# EAGLE design cryptocape (EAGLE 6.5.0)
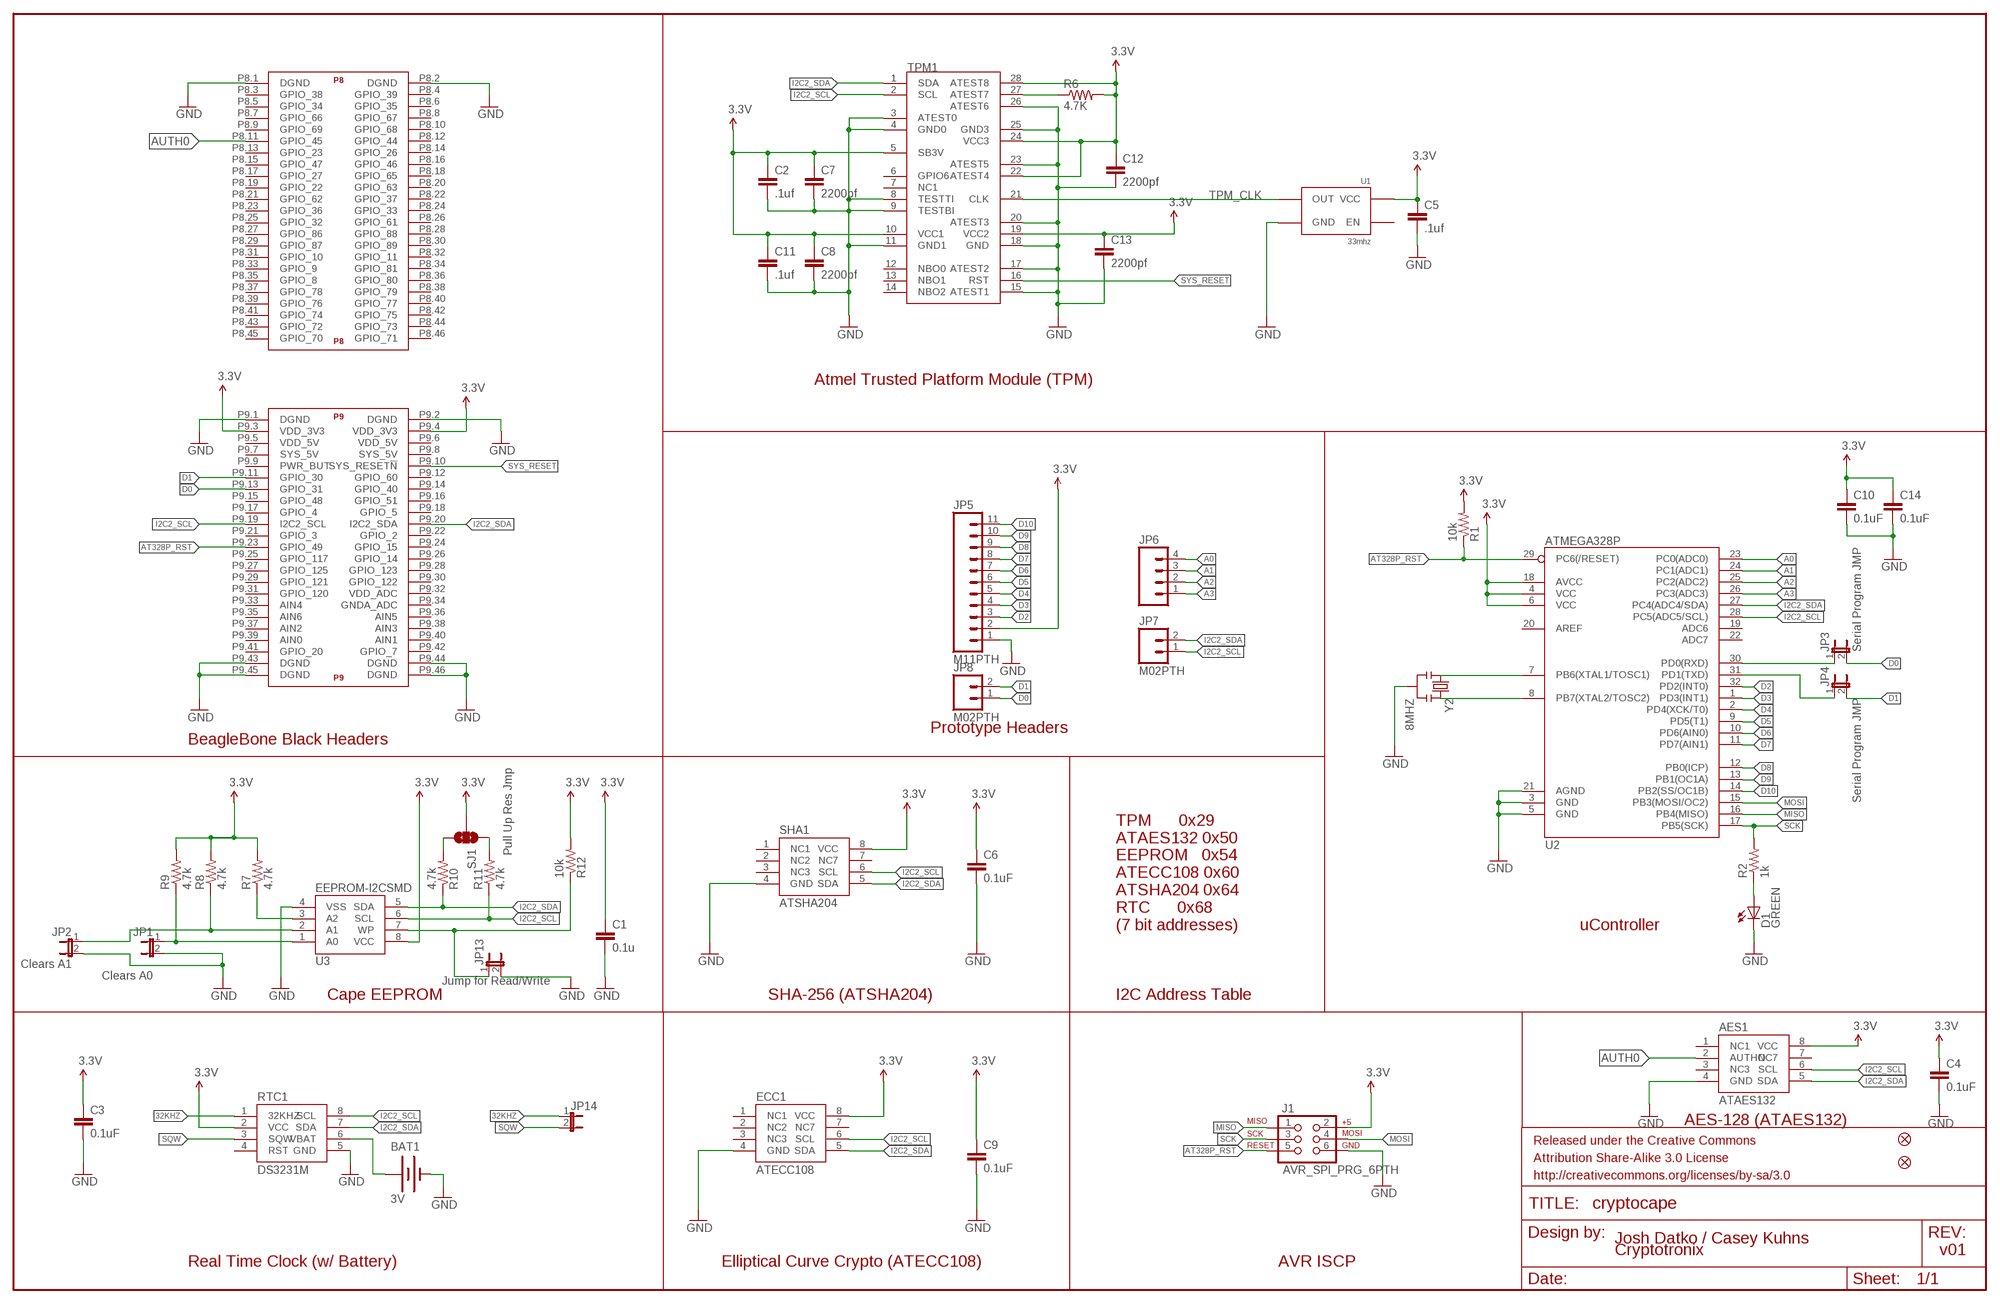
[diagram p0: schematic, sheet 1]

## Parts
AES1  ATAES132  [SOIC8]
BAT1  3V  BATTERY12MM  [BATTCON_12MM]
C1  0.1u  0.1UF-25V(+80/-20%)(0603)  [0603-CAP]
C2  .1uf  0.1UF-25V(+80/-20%)(0603)  [0603-CAP]
C3  0.1uF  0.1UF-25V(+80/-20%)(0603)  [0603-CAP]
C4  0.1uF  0.1UF-25V(+80/-20%)(0603)  [0603-CAP]
C5  .1uf  0.1UF-25V(+80/-20%)(0603)  [0603-CAP]
C6  0.1uF  0.1UF-25V(+80/-20%)(0603)  [0603-CAP]
C7  2200pf  2.2NF/2200PF-50V-10%(0603)  [0603-CAP]
C8  2200pf  2.2NF/2200PF-50V-10%(0603)  [0603-CAP]
C9  0.1uF  0.1UF-25V(+80/-20%)(0603)  [0603-CAP]
C10  0.1uF  0.1UF-25V(+80/-20%)(0603)  [0603-CAP]
C11  .1uf  0.1UF-25V(+80/-20%)(0603)  [0603-CAP]
C12  2200pf  2.2NF/2200PF-50V-10%(0603)  [0603-CAP]
C13  2200pf  2.2NF/2200PF-50V-10%(0603)  [0603-CAP]
C14  0.1uF  0.1UF-25V(+80/-20%)(0603)  [0603-CAP]
D1  GREEN  LED-GREEN0603  [LED-0603]
ECC1  ATECC108  [SOIC8]
FID1  FIDUCIAL1X2  [FIDUCIAL-1X2]
FID2  FIDUCIAL1X2  [FIDUCIAL-1X2]
FRAME1  FRAME-LEDGER  [CREATIVE_COMMONS]
J1  AVR_SPI_PRG_6PTH  [2X3]
JP1  Clears A0  JUMPER-2SMD-NO  [SJ_2S-NO]
JP2  Clears A1  JUMPER-2SMD-NO  [SJ_2S-NO]
JP3  Serial Program JMP  JUMPER-2PTH  [1X02]
JP4  Serial Program JMP  JUMPER-2PTH  [1X02]
JP5  M11PTH  [1X11]
JP6  M04PTH  [1X04]
JP7  M02PTH  [1X02]
JP8  M02PTH  [1X02]
JP13  Jump for Read/Write  JUMPER-2PTH  [1X02]
JP14  JUMPER-2PTH  [1X02]
R1  10k  10KOHM1/10W1%(0603)0603  [0603-RES]
R2  1k  1K-1%  [0603-RES]
R6  4.7K  4.7KOHM1/10W1%(0603)  [0603]
R7  4.7k  4.7KOHM1/10W1%(0603)  [0603]
R8  4.7k  4.7KOHM1/10W1%(0603)  [0603]
R9  4.7k  4.7KOHM1/10W1%(0603)  [0603]
R10  4.7k  4.7KOHM1/10W1%(0603)  [0603]
R11  4.7k  4.7KOHM1/10W1%(0603)  [0603]
R12  10k  10KOHM1/10W1%(0603)0603  [0603-RES]
RTC1  DS3231M  [SOIC8]
SHA1  ATSHA204  [SOIC8]
SJ1  Pull Up Res Jmp  SOLDERJUMPER_2WAYPASTE1&2&3  [SJ_3_PASTE1&2&3]
TPM1  AT97SC3204T  [TSSOP28]
U1  33mhz  OSCILLATOR  [CRYSTAL-OSC-SMD-5X3.2]
U2  ATMEGA328P  ATMEGA328_SMT  [TQFP32-08]
U3  EEPROM-I2CSMD  [SO08]
U$2  BEAGLE_BONE_BLACK_CAPE  [BEAGLE_BONE_BLACK_CAPE]
Y2  8MHZ  RESONATOR8MHZ  [RESONATOR-SMD]

## Nets
3.3V: AES1.8(VCC) C1.1 C2.1 C3.1 C4.1 C5.1 C6.1 C7.1 C8.1 C9.1 C10.1 C11.1 C12.1 C13.1 C14.1 ECC1.8(VCC) J1.2 JP5.2 R1.2 R6.2 R7.2 R8.2 R9.2 R12.2 RTC1.2(VCC) SHA1.8(VCC) SJ1.2 TPM1.5(SB3V) TPM1.10(VCC1) TPM1.19(VCC2) TPM1.22(ATEST4) TPM1.24(VCC3) TPM1.28(ATEST8) U1.4(VCC) U2.4(VCC) U2.6(VCC) U2.18(AVCC) U3.8(VCC) U$2.P9.3(P9:VDD_3V3) U$2.P9.4(P9:VDD_3V3)
32KHZ: JP14.1 RTC1.1(32KHZ)
A0: JP6.4 U2.23(PC0(ADC0))
A1: JP6.3 U2.24(PC1(ADC1))
A2: JP6.2 U2.25(PC2(ADC2))
A3: JP6.1 U2.26(PC3(ADC3))
AT328P_RST: J1.5 R1.1 U2.29(PC6(/RESET)) U$2.P9.23(P9:GPIO_49)
AUTH0: AES1.2(AUTHO) U$2.P8.11(P8:GPIO_45)
D0: JP3.2 JP8.1 U$2.P9.13(P9:GPIO_31)
D0': JP3.1 U2.30(PD0(RXD))
D1: JP4.2 JP8.2 U$2.P9.11(P9:GPIO_30)
D1': JP4.1 U2.31(PD1(TXD))
D2: JP5.3 U2.32(PD2(INT0))
D3: JP5.4 U2.1(PD3(INT1))
D4: JP5.5 U2.2(PD4(XCK/T0))
D5: JP5.6 U2.9(PD5(T1))
D6: JP5.7 U2.10(PD6(AIN0))
D7: JP5.8 U2.11(PD7(AIN1))
D8: JP5.9 U2.12(PB0(ICP))
D9: JP5.10 U2.13(PB1(OC1A))
D10: JP5.11 U2.14(PB2(SS/OC1B))
GND: AES1.4(GND) BAT1.GND(-) C1.2 C2.2 C3.2 C4.2 C5.2 C6.2 C7.2 C8.2 C9.2 C10.2 C11.2 C12.2 C13.2 C14.2 D1.C ECC1.4(GND) J1.6 JP1.2 JP2.2 JP5.1 JP13.2 RTC1.5(GND) SHA1.4(GND) TPM1.3(ATEST0) TPM1.4(GND0) TPM1.8(TESTTI) TPM1.9(TESTBI) TPM1.11(GND1) TPM1.15(ATEST1) TPM1.17(ATEST2) TPM1.18(GND) TPM1.20(ATEST3) TPM1.23(ATEST5) TPM1.25(GND3) TPM1.26(ATEST6) U1.2(GND) U2.3(GND) U2.5(GND) U2.21(AGND) U3.4(VSS) U$2.P8.1(P8:DGND) U$2.P8.2(P8:DGND) U$2.P9.1(P9:DGND) U$2.P9.2(P9:DGND) U$2.P9.43(P9:DGND) U$2.P9.44(P9:DGND) U$2.P9.45(P9:DGND) U$2.P9.46(P9:DGND) Y2.2
I2C2_SCL: AES1.6(SCL) ECC1.6(SCL) JP7.1 R11.1 RTC1.8(SCL) SHA1.6(SCL) TPM1.2(SCL) U2.28(PC5(ADC5/SCL)) U3.6(SCL) U$2.P9.19(P9:I2C2_SCL)
I2C2_SDA: AES1.5(SDA) ECC1.5(SDA) JP7.2 R10.1 RTC1.7(SDA) SHA1.5(SDA) TPM1.1(SDA) U2.27(PC4(ADC4/SDA)) U3.5(SDA) U$2.P9.20(P9:I2C2_SDA)
MISO: J1.1 U2.16(PB4(MISO))
MOSI: J1.4 U2.15(PB3(MOSI/OC2))
N$1: JP13.1 R12.1 U3.7(WP)
N$4: U2.7(PB6(XTAL1/TOSC1)) Y2.1
N$5: U2.8(PB7(XTAL2/TOSC2)) Y2.3
N$12: D1.A R2.1
N$18: R7.1 U3.3(A2)
N$19: R6.1 TPM1.27(ATEST7)
N$20: JP2.1 R8.1 U3.2(A1)
N$21: JP1.1 R9.1 U3.1(A0)
N$22: R10.2 SJ1.3
N$23: R11.2 SJ1.1
SCK: J1.3 R2.2 U2.17(PB5(SCK))
SQW: JP14.2 RTC1.3(SQW)
SYS_RESET: TPM1.16(RST) U$2.P9.10(P9:SYS_RESET!N)
TPM_CLK: TPM1.21(CLK) U1.3(OUT)
VBAT: BAT1.PWR@1(+) RTC1.6(VBAT)
Unconnected: AES1.1(NC1) AES1.3(NC3) AES1.7(NC7) ECC1.1(NC1) ECC1.2(NC2) ECC1.3(NC3) ECC1.7(NC7) RTC1.4(RST) SHA1.1(NC1) SHA1.2(NC2) SHA1.3(NC3) SHA1.7(NC7) TPM1.6(GPIO6) TPM1.7(NC1) TPM1.12(NBO0) TPM1.13(NBO1) TPM1.14(NBO2) U1.1(EN) U2.19(ADC6) U2.20(AREF) U2.22(ADC7) U$2.P8.3(P8:GPIO_38) U$2.P8.4(P8:GPIO_39) U$2.P8.5(P8:GPIO_34) U$2.P8.6(P8:GPIO_35) U$2.P8.7(P8:GPIO_66) U$2.P8.8(P8:GPIO_67) U$2.P8.9(P8:GPIO_69) U$2.P8.10(P8:GPIO_68) U$2.P8.12(P8:GPIO_44) U$2.P8.13(P8:GPIO_23) U$2.P8.14(P8:GPIO_26) U$2.P8.15(P8:GPIO_47) U$2.P8.16(P8:GPIO_46) U$2.P8.17(P8:GPIO_27) U$2.P8.18(P8:GPIO_65) U$2.P8.19(P8:GPIO_22) U$2.P8.20(P8:GPIO_63) U$2.P8.21(P8:GPIO_62) U$2.P8.22(P8:GPIO_37) U$2.P8.23(P8:GPIO_36) U$2.P8.24(P8:GPIO_33) U$2.P8.25(P8:GPIO_32) U$2.P8.26(P8:GPIO_61) U$2.P8.27(P8:GPIO_86) U$2.P8.28(P8:GPIO_88) U$2.P8.29(P8:GPIO_87) U$2.P8.30(P8:GPIO_89) U$2.P8.31(P8:GPIO_10) U$2.P8.32(P8:GPIO_11) U$2.P8.33(P8:GPIO_9) U$2.P8.34(P8:GPIO_81) U$2.P8.35(P8:GPIO_8) U$2.P8.36(P8:GPIO_80) U$2.P8.37(P8:GPIO_78) U$2.P8.38(P8:GPIO_79) U$2.P8.39(P8:GPIO_76) U$2.P8.40(P8:GPIO_77) U$2.P8.41(P8:GPIO_74) U$2.P8.42(P8:GPIO_75) U$2.P8.43(P8:GPIO_72) U$2.P8.44(P8:GPIO_73) U$2.P8.45(P8:GPIO_70) U$2.P8.46(P8:GPIO_71) U$2.P9.5(P9:VDD_5V) U$2.P9.6(P9:VDD_5V) U$2.P9.7(P9:SYS_5V) U$2.P9.8(P9:SYS_5V) U$2.P9.9(P9:PWR_BUT) U$2.P9.12(P9:GPIO_60) U$2.P9.14(P9:GPIO_40) U$2.P9.15(P9:GPIO_48) U$2.P9.16(P9:GPIO_51) U$2.P9.17(P9:GPIO_4) U$2.P9.18(P9:GPIO_5) U$2.P9.21(P9:GPIO_3) U$2.P9.22(P9:GPIO_2) U$2.P9.24(P9:GPIO_15) U$2.P9.25(P9:GPIO_117) U$2.P9.26(P9:GPIO_14) U$2.P9.27(P9:GPIO_125) U$2.P9.28(P9:GPIO_123) U$2.P9.29(P9:GPIO_121) U$2.P9.30(P9:GPIO_122) U$2.P9.31(P9:GPIO_120) U$2.P9.32(P9:VDD_ADC) U$2.P9.33(P9:AIN4) U$2.P9.34(P9:GNDA_ADC) U$2.P9.35(P9:AIN6) U$2.P9.36(P9:AIN5) U$2.P9.37(P9:AIN2) U$2.P9.38(P9:AIN3) U$2.P9.39(P9:AIN0) U$2.P9.40(P9:AIN1) U$2.P9.41(P9:GPIO_20) U$2.P9.42(P9:GPIO_7)

## Notes on the sheet
- Atmel Trusted Platform Module (TPM)
- Prototype Headers
- BeagleBone Black Headers
- TPM      0x29
  ATAES132 0x50
  EEPROM   0x54
  ATECC108 0x60
  ATSHA204 0x64
  RTC      0x68
  (7 bit addresses)
- uController
- Cape EEPROM | SHA-256 (ATSHA204) | I2C Address Table
- AES-128 (ATAES132)
- Josh Datko / Casey Kuhns
- Cryptotronix | v01
- Real Time Clock (w/ Battery) | Elliptical Curve Crypto (ATECC108) | AVR ISCP

## Library data of the parts
AES1 = cryptotronix:ATAES132: 32Kb Serial EEPROM. AES-128-CCM. MAC. Secure Storage for 128-bit keys. Encrypted User Memory Readn and Write. HWRNG. 2.5V to 5.5V.
BAT1 = SparkFun-Electromechanical:BATTERY: Battery Holders Various common sizes : AA, AAA, 20mm coin cell and 12mm coin cell. 20MM_4LEGS, BATT-10373
C1 C2 C5 C11 = SparkFun-Capacitors:0.1UF-25V(+80/-20%)(0603): CAP-00810 Ceramic Standard decoupling cap; PROD_ID: CAP-00810; VALUE: 0.1uF
C3 C4 C6 C9 C10 C14 = SparkFun-Capacitors:0.1UF-25V(+80/-20%)(0603): CAP-00810 Ceramic Standard decoupling cap; PROD_ID: CAP-00810
C7 C8 C12 C13 = SparkFun-Capacitors:2.2NF/2200PF-50V-10%(0603): CAP-07877; PROD_ID: CAP-07877; VALUE: 2.2nF
D1 = SparkFun-LED:LED-GREEN: Various green LEDs 0603- DIO-00821 LARGE- DIO-00862 LILYPAD- DIO-09910; PROD_ID: DIO-00821
ECC1 = cryptotronix:ATECC108: ATECC108: Provides ECDSA with NIST curves P256, B283, and K283. Also, a RNG, 8.5Kb EEPROM. 2.0V - 5.5V.
FID1 FID2 = SparkFun-Aesthetics:FIDUCIAL: Fiducial Alignment Points Various fiducial points for machine vision alignment.
FRAME1 = SparkFun-Aesthetics:FRAME-LEDGER: Schematic Frame Standard 11x14 US Ledger frame
J1 = SparkFun-Connectors:AVR_SPI_PRG_6: AVR ISP 6 Pin This is the reduced ISP connector for AVR programming. Common on Arduino. This footprint will take up less PCB space and can be used with a 10-pin to 6-pin adapter such as SKU: BOB-08508
JP1-JP4 JP13 JP14 = SparkFun-Passives:JUMPER-2: Jumper Basic 0.1" spaced jumper. Use with breakaway headers.
JP5 = SparkFun-Connectors:M11: Header 11 Standard 11-pin 0.1" header. Use with straight break away headers (SKU : PRT-00116), right angle break away headers (PRT-00553), swiss pins (PRT-00743), machine pins (PRT-00117), and female headers (PRT-00115).
JP6 = SparkFun-Connectors:M04: Header 4 Standard 4-pin 0.1" header. Use with straight break away headers (SKU : PRT-00116), right angle break away headers (PRT-00553), swiss pins (PRT-00743), machine pins (PRT-00117), and female headers (PRT-00115). Molex polarized connector foot print use with SKU : PRT-08231 with associated crimp pins and housings. 1MM SMD Version SKU: PRT-10208
JP7 JP8 = SparkFun-Connectors:M02: Standard 2-pin 0.1" header. Use with - straight break away headers ( PRT-00116) - right angle break away headers (PRT-00553) - swiss pins (PRT-00743) - machine pins (PRT-00117) - female headers (PRT-00115) Molex polarized connector foot print use with: PRT-08233 with associated crimp pins and housings. 2.54_SCREWTERM for use with PRT-10571. 3.5mm Screw Terminal footprints for PRT-08084 5mm Screw Terminal footprints for use with PRT-08433
R1 R12 = SparkFun-Resistors:10KOHM1/10W1%(0603): RES-00824; PROD_ID: RES-00824; VALUE: 10K
R2 = SparkFun-Resistors:1K-1%: 1k-ohm SMT 1/10W - 1% (0603) RES-07856; PROD_ID: RES-07856
R6-R11 = SparkFun-Resistors:4.7KOHM1/10W1%(0603): RES-07857; PROD_ID: RES-07857
RTC1 = cryptotronix:DS3231M: DS3231M Real Time Clock. Accuracy +/-5ppm. Battery Backup. 2.3V to 5.5V.
SHA1 = cryptotronix:ATSHA204: ATSHA204
SJ1 = SparkFun-Passives:SOLDERJUMPER_2WAY: Solder Jumper 2 way solder jumper
TPM1 = cryptotronix:AT97SC3204T: Atmel TPM 1.2
U1 = cryptotronix:OSCILLATOR: Generic 5x3.2 Oscillator
U2 = SparkFun-DigitalIC:ATMEGA328_SMT: 32-Pin Atmega328 part Commonly used on Arduino compatible boards Available in QFP and QFN packages TQFP is IC-09069 QFN is non-stock; PROD_ID: IC-09069
U3 = SparkFun-DigitalIC:EEPROM-I2C: I2C EEPROM chips, 24LC256 (and others)
U$2 = SparkFun-Boards:BEAGLE_BONE_BLACK_CAPE
Y2 = SparkFun-FreqCtrl:RESONATOR: Resonator Small SMD resonator. Used, eg, on the Arduino Pro/ Pro Mini boards. 8MHz- XTAL-08895 16MHz- XTAL-08900; PROD_ID: XTAL-08895

## Board
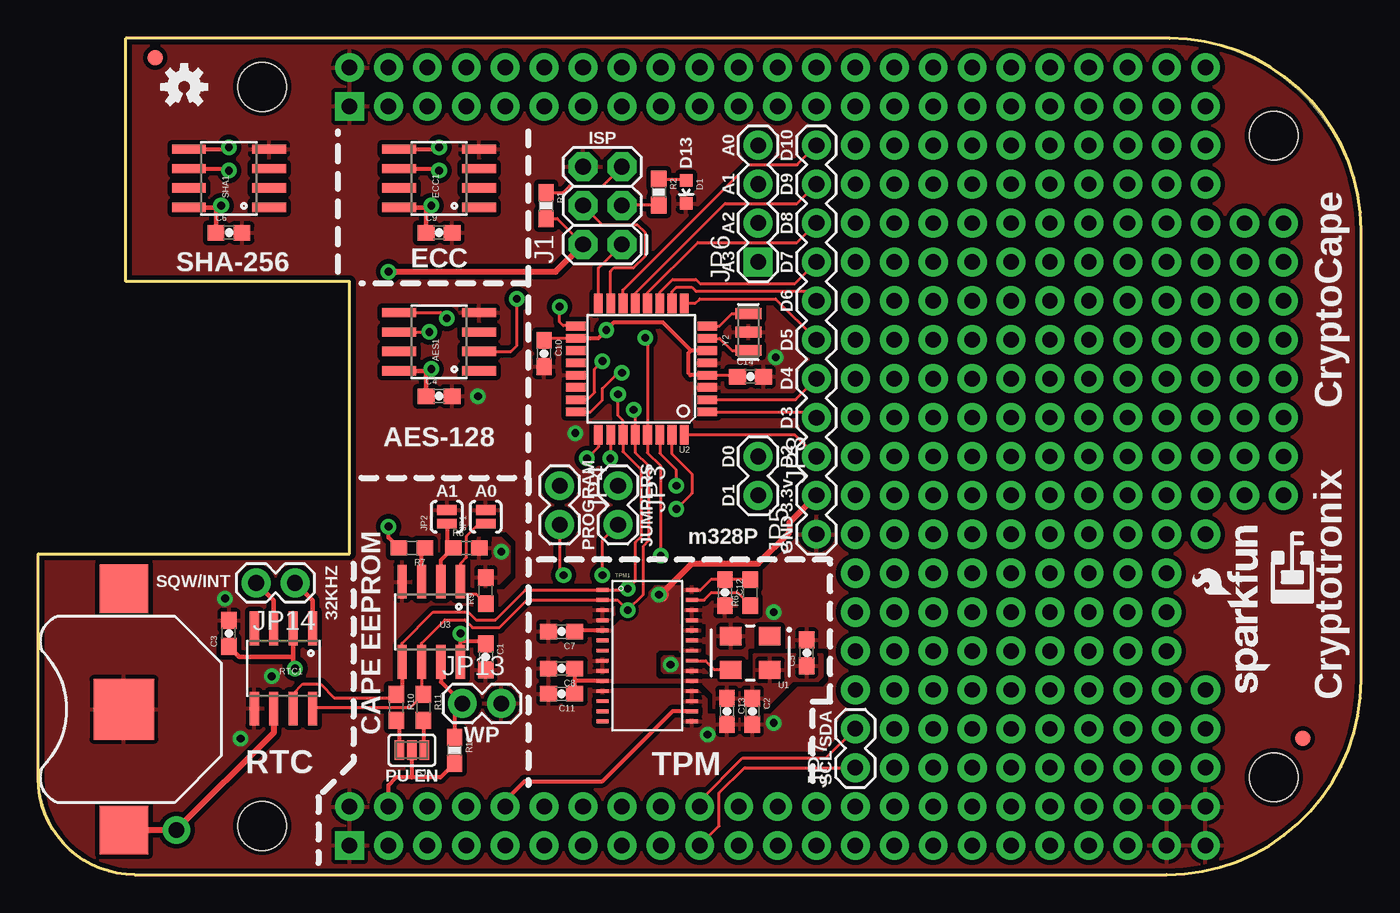
[diagram p1: board, top side]
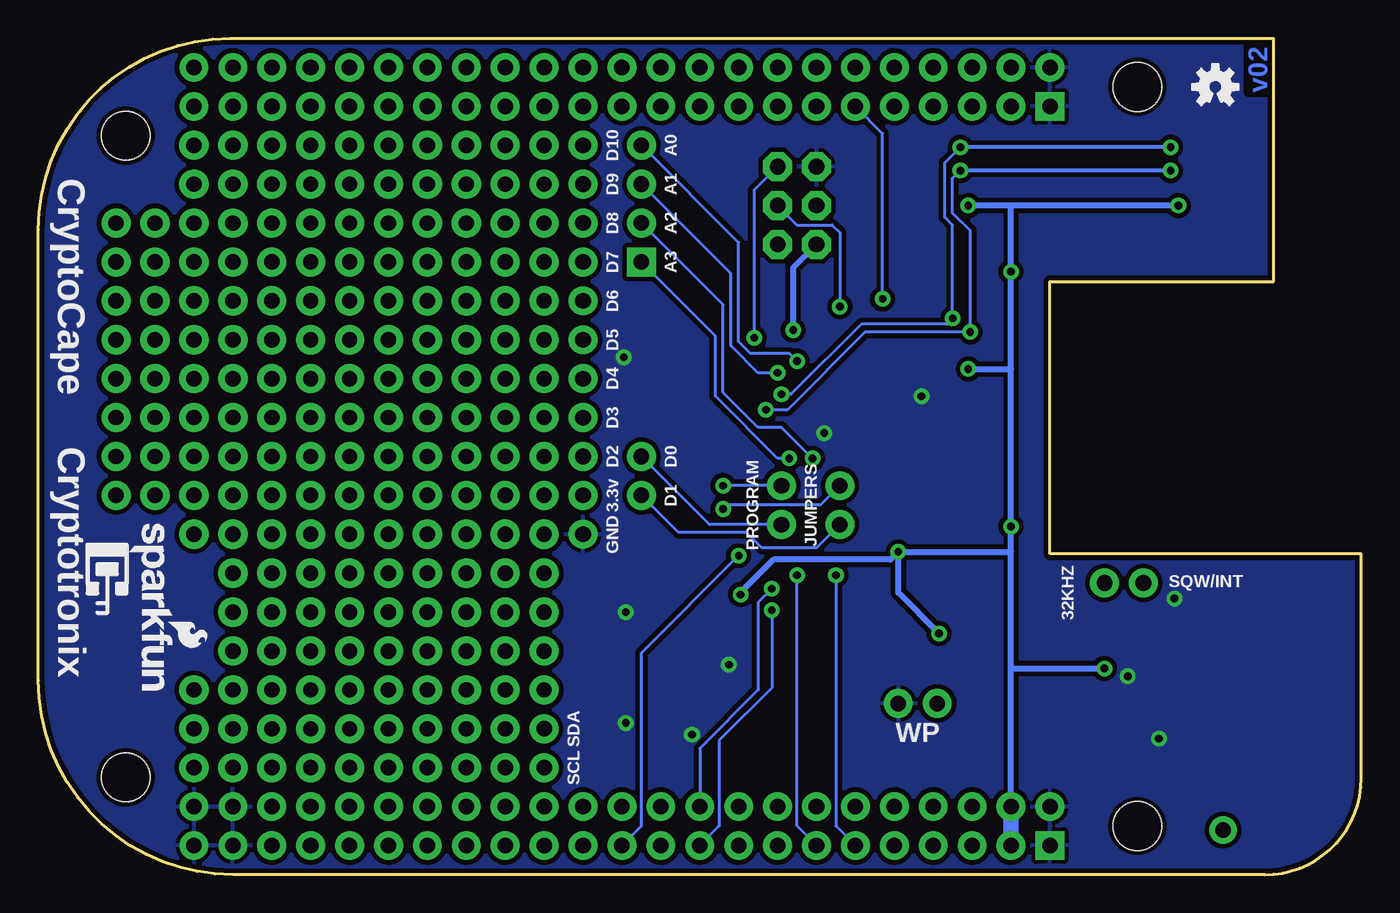
[diagram p2: board, bottom side, seen from below]

Size 86.36 x 54.61 mm. Coordinates in mm from the lower left corner, seen from the top.
Outline: 6.29,0 73.66,0 arc90 86.36,12.7 86.36,42.1 arc90 73.85,54.61 5.71,54.61 5.71,38.73 20.32,38.73 20.32,20.95 0,20.95 0,6.29 arc90 6.29,0
Copper layers (1*16): Top 0.035mm / dielectric 1.5mm / Bottom 0.035mm
Design rules "SparkFun-2-layer": minimum track width 7mil, minimum drill 15mil, track to track 8mil, track to pad 8mil, pad to pad 8mil, via to via 8mil, smd to smd 8mil, copper to edge 8mil, drill to drill 8mil, minimum pad ring 12mil, minimum via ring 10mil, stop-mask expansion 4mil, vias tented up to drill 20mil, thermal gap 10mil

### Footprints (pad centres in the part's own frame; a part is rotated, then mirrored left to right if it is on the bottom)
SOIC8 = smd 0.61 x 2.21: 1 -1.905,-2.616; 2 -0.635,-2.616; 3 0.635,-2.616; 4 1.905,-2.616; 5 1.905,2.616; 6 0.635,2.616; 7 -0.635,2.616; 8 -1.905,2.616
BATTCON_12MM = smd 3.962 x 3.962: GND 0,0 | smd 3.175 x 3.175: PWR@1 -7.874,0; PWR@2 7.874,0
0603-CAP = smd 1.1 x 1: 1 -0.85,0; 2 0.85,0
LED-0603 = smd 0.8 x 0.8: A 0,-0.75; C 0,0.75
FIDUCIAL-1X2 = smd 1 x 1: 1 0,0
2X3 = drill 1.016 pad 1.88 octagon: 1 0,0; 2 0,2.54; 3 2.54,0; 4 2.54,2.54; 5 5.08,0; 6 5.08,2.54
SJ_2S-NO = smd 0.635 x 1.27: 1 -0.45,0; 2 0.45,0
1X02 = drill 1.016 pad 1.88: 1 0,0; 2 2.54,0
1X11 = drill 1.016 pad 1.88: 1 0,0; 2 2.54,0; 3 5.08,0; 4 7.62,0; 5 10.16,0; 6 12.7,0; 7 15.24,0; 8 17.78,0; 9 20.32,0; 10 22.86,0; 11 25.4,0
1X04 = drill 1.016 pad 1.88 square: 1 0,0 | drill 1.016 pad 1.88: 2 2.54,0; 3 5.08,0; 4 7.62,0
0603-RES = smd 1.1 x 1: 1 -0.85,0; 2 0.85,0
0603 = smd 1.1 x 1: 1 -0.85,0; 2 0.85,0
SJ_3_PASTE1&2&3 = smd 0.635 x 1.27: 1 -0.813,0; 2 0,0; 3 0.813,0
TSSOP28 = smd 0.8 x 0.25: 1 -2.921,4.623; 2 -2.921,3.962; 3 -2.921,3.302; 4 -2.921,2.642; 5 -2.921,1.981; 6 -2.921,1.321; 7 -2.921,0.66; 8 -2.927,0; 9 -2.921,-0.66; 10 -2.921,-1.321; 11 -2.921,-1.981; 12 -2.921,-2.642; 13 -2.921,-3.302; 14 -2.921,-3.962; 15 2.921,-3.962; 16 2.921,-3.302; 17 2.921,-2.642; 18 2.921,-1.981; 19 2.921,-1.321; 20 2.921,-0.66; 21 2.927,0; 22 2.921,0.66; 23 2.921,1.321; 24 2.921,1.981; 25 2.921,2.642; 26 2.921,3.302; 27 2.921,3.962; 28 2.921,4.623
CRYSTAL-OSC-SMD-5X3.2 = smd 1.397 x 1.194: 1 -1.27,-1.1; 2 1.27,-1.1; 3 1.27,1.1; 4 -1.27,1.1
TQFP32-08 = smd 1.27 x 0.559: 1 -4.293,2.8; 2 -4.293,2; 3 -4.293,1.2; 4 -4.293,0.4; 5 -4.293,-0.4; 6 -4.293,-1.2; 7 -4.293,-2; 8 -4.293,-2.8; 17 4.293,-2.8; 18 4.293,-2; 19 4.293,-1.2; 20 4.293,-0.4; 21 4.293,0.4; 22 4.293,1.2; 23 4.293,2; 24 4.293,2.8 | smd 0.559 x 1.27: 9 -2.8,-4.293; 10 -2,-4.293; 11 -1.2,-4.293; 12 -0.4,-4.293; 13 0.4,-4.293; 14 1.2,-4.293; 15 2,-4.293; 16 2.8,-4.293; 25 2.8,4.293; 26 2,4.293; 27 1.2,4.293; 28 0.4,4.293; 29 -0.4,4.293; 30 -1.2,4.293; 31 -2,4.293; 32 -2.8,4.293
SO08 = smd 0.61 x 2.21: 1 -1.905,-2.616; 2 -0.635,-2.616; 3 0.635,-2.616; 4 1.905,-2.616; 5 1.905,2.616; 6 0.635,2.616; 7 -0.635,2.616; 8 -1.905,2.616
BEAGLE_BONE_BLACK_CAPE = drill 1.016 pad 1.88 square: P8.1 20.32,50.165; P9.1 20.32,1.905 | drill 1.016 pad 1.88: P8.2 20.32,52.705; P8.3 22.86,50.165; P8.4 22.86,52.705; P8.5 25.4,50.165; P8.6 25.4,52.705; P8.7 27.94,50.165; P8.8 27.94,52.705; P8.9 30.48,50.165; P8.10 30.48,52.705; P8.11 33.02,50.165; P8.12 33.02,52.705; P8.13 35.56,50.165; P8.14 35.56,52.705; P8.15 38.1,50.165; P8.16 38.1,52.705; P8.17 40.64,50.165; P8.18 40.64,52.705; P8.19 43.18,50.165; P8.20 43.18,52.705; P8.21 45.72,50.165; P8.22 45.72,52.705; P8.23 48.26,50.165; P8.24 48.26,52.705; P8.25 50.8,50.165; P8.26 50.8,52.705; P8.27 53.34,50.165; P8.28 53.34,52.705; P8.29 55.88,50.165; P8.30 55.88,52.705; P8.31 58.42,50.165; P8.32 58.42,52.705; P8.33 60.96,50.165; P8.34 60.96,52.705; P8.35 63.5,50.165; P8.36 63.5,52.705; P8.37 66.04,50.165; P8.38 66.04,52.705; P8.39 68.58,50.165; P8.40 68.58,52.705; P8.41 71.12,50.165; P8.42 71.12,52.705; P8.43 73.66,50.165; P8.44 73.66,52.705; P8.45 76.2,50.165; P8.46 76.2,52.705; P9.2 20.32,4.445; P9.3 22.86,1.905; P9.4 22.86,4.445; P9.5 25.4,1.905; P9.6 25.4,4.445; P9.7 27.94,1.905; P9.8 27.94,4.445; P9.9 30.48,1.905; P9.10 30.48,4.445; P9.11 33.02,1.905; P9.12 33.02,4.445; P9.13 35.56,1.905; P9.14 35.56,4.445; P9.15 38.1,1.905; P9.16 38.1,4.445; P9.17 40.64,1.905; P9.18 40.64,4.445; P9.19 43.18,1.905; P9.20 43.18,4.445; P9.21 45.72,1.905; P9.22 45.72,4.445; P9.23 48.26,1.905; P9.24 48.26,4.445; P9.25 50.8,1.905; P9.26 50.8,4.445; P9.27 53.34,1.905; P9.28 53.34,4.445; P9.29 55.88,1.905; P9.30 55.88,4.445; P9.31 58.42,1.905; P9.32 58.42,4.445; P9.33 60.96,1.905; P9.34 60.96,4.445; P9.35 63.5,1.905; P9.36 63.5,4.445; P9.37 66.04,1.905; P9.38 66.04,4.445; P9.39 68.58,1.905; P9.40 68.58,4.445; P9.41 71.12,1.905; P9.42 71.12,4.445; P9.43 73.66,1.905; P9.44 73.66,4.445; P9.45 76.2,1.905; P9.46 76.2,4.445 | hole 3.175: 14.605,3.175; 80.645,6.35; 80.645,48.26; 14.605,51.435
RESONATOR-SMD = smd 0.7 x 1.7: 1 -1.2,0; 2 0,0; 3 1.2,0

### Placement (x,y rotation side)
AES1  26.16,34.8 90 top
BAT1  5.59,10.79 90 top
C1  29.21,14.22 270 top
C2  46.61,10.67 270 top
C3  12.45,15.75 90 top
C4  26.16,31.24 0 top
C5  50.16,14.48 90 top
C6  12.45,41.91 0 top
C7  34.16,15.88 180 top
C8  34.16,13.46 180 top
C9  26.16,41.91 0 top
C10  33.02,34.04 270 top
C11  34.16,11.81 180 top
C12  44.83,18.41 270 top
C13  44.96,10.67 270 top
C14  46.48,32.51 0 top
D1  42.29,44.58 180 top
ECC1  26.16,45.47 90 top
FID1  7.62,53.34 0 top
FID2  82.55,8.89 0 top
FRAME1  24.13,-11.43 0 top  (outside the outline)
J1  38.1,41.15 90 top
JP1  29.21,23.37 90 top
JP2  26.67,23.37 90 top
JP3  37.85,25.4 270 top
JP4  34.04,25.4 270 top
JP5  50.8,22.23 90 top
JP6  46.99,40.01 90 top
JP7  53.34,6.99 90 top
JP8  46.99,27.3 270 top
JP13  27.69,11.18 0 top
JP14  16.76,19.05 180 top
R1  33.15,43.69 270 top
R2  40.51,44.58 270 top
R6  46.48,18.41 90 top
R7  24.38,21.34 180 top
R8  27.94,21.34 0 top
R9  29.21,18.54 90 top
R10  23.37,10.92 270 top
R11  25.15,10.92 270 top
R12  27.18,8.13 270 top
RTC1  16,13.46 180 top
SHA1  12.45,45.47 90 top
SJ1  24.38,8.13 180 top
TPM1  39.75,13.97 0 top
U1  46.48,14.48 180 top
U2  39.37,33.02 180 top
U3  25.65,16.51 180 top
U$2  0,0 0 top
U$3  [OSHW-LOGO-S]  9.53,51.44 0 top
U$4  [SFE_LOGO_NAME_FLAME_.1]  80.52,11.43 90 top
U$5  [SFE_LOGO_NAME_FLAME_.1]  80.52,23.37 270 bottom
U$6  [OSHW-LOGO-S]  9.53,51.44 0 bottom
Y2  46.35,35.43 90 top

### Tracks (layer width: path | path; a pad name or v marks a point on that pad's centre or on a via)
3.3V  (via drill 0.51)
  Top 0.203: TPM1.28 43.23,18.59 43.9,19.27 C12.1 R6.2 | U2.18 33.15,35.02 C10.1 | U2.4 45.19,32.62 C14.1 | R1.2 33.87,42.84 J1.2
  Top 0.254: R12.2 26.25,6.35 24.38,6.35 | SJ1.2 24.38,6.35 | U$2.P9.4 22.86,5.84 23.37,6.35 24.38,6.35 | U3.8 27.56,15.24 | 27.56,15.24 v27.56,15.75 | C1.1 29.04,15.24 27.56,15.24 | R7.2 22.86,22.01 v22.86,22.73 | C8.1 35.01,12.65 | 35.01,12.65 C11.1 | TPM1.10 35.01,12.65 | TPM1.5 35.14,15.95 C7.1 | U2.4 42.56,32.62 42.42,32.77 42.42,34.04 42.6,34.22 | U2.6 42.6,34.22 | 42.6,34.22 40.75,36.07 37.59,36.07 v37.08,35.56 36.54,35.02 U2.18
  Top 0.305: RTC1.2 16.64,14.22 | 16.64,14.22 16.64,13.46 v16.76,13.46 | C3.1 13.12,14.22 16.64,14.22 | AES1.8 25.53,32.89 v25.65,33.02 25.31,32.68 C4.1 | ECC1.8 25.53,43.56 | 25.53,43.56 v25.65,43.69 | C9.1 25.31,43.35 25.53,43.56 | SHA1.8 11.81,43.56 v11.94,43.69 11.6,43.35 C6.1
  Top 0.406: v22.86,39.37 33.78,39.37 J1.2 | 40.64,18.29 42.67,20.32 46.99,20.32 49.02,22.35 49.02,22.99 JP5.2
  Top 1.016: v40.51,18.29 40.64,18.29
  Bottom 0.406: U$2.P9.4 22.86,13.46 | 22.86,13.46 v16.76,13.46 | 22.86,13.46 22.86,21.08 | 22.86,21.08 v22.86,22.73 22.86,33.02 | v27.56,15.75 30.23,18.41 v30.23,21.08 | v30.23,21.08 22.86,21.08 | 40.51,18.54 v40.51,18.29 40.51,18.41 38.35,20.57 30.73,20.57 v30.23,21.08 | 22.86,33.02 v22.86,39.37 22.86,43.69 | v11.94,43.69 22.86,43.69 | 22.86,43.69 v25.65,43.69 | v25.65,33.02 22.86,33.02 | J1.2 37.08,39.62 v37.08,35.56
  Bottom 1.016: U$2.P9.3 U$2.P9.4
  pour Top: 28.32,21.97 30.23,21.97 30.73,21.46 30.73,19.68 29.84,18.8 28.32,18.8
  pour Top: 36.32,16.13 36.32,15.88 37.59,15.88 37.59,12.7 36.32,12.7 36.32,12.57 43.31,12.57 44.07,11.81 44.07,10.92 47.5,10.92 49.28,12.7 50.93,12.7 51.18,12.95 51.18,14.35 46.74,14.35 46.74,12.7 40.51,12.7 40.26,12.95 40.26,14.48 40.51,14.73 41.78,14.73 41.91,14.61 43.18,14.61 43.18,14.73 41.91,14.73 41.91,15.88 43.18,15.88 43.18,16.13 42.04,16.13 41.78,16.38 41.78,18.16 42.04,18.41 43.18,18.41 43.18,18.8 40.26,18.8 37.59,16.13
32KHZ
  Top 0.305: RTC1.1 17.91,17.91 JP14.1
A0  (via drill 0.51)
  Top 0.203: U2.23 35.85,31.02 36.32,31.5 36.32,33.02 v36.83,33.53
  Bottom 0.203: v36.83,33.53 37.34,34.04 39.88,34.04 40.64,34.8 40.64,41.27 JP6.4
A1  (via drill 0.51)
  Top 0.203: U2.24 36.06,30.22 36.83,30.99 36.83,31.75 37.85,32.77 v38.1,32.77
  Bottom 0.203: v38.1,32.77 39.37,32.77 41.15,34.54 41.15,39.24 JP6.3
A2  (via drill 0.51)
  Top 0.203: U2.25 36.57,27.93 v35.81,27.18
  Bottom 0.203: v35.81,27.18 37.85,29.21 39.37,29.21 41.66,31.5 41.66,37.21 JP6.2
A3  (via drill 0.51)
  Top 0.203: U2.26 37.37,27.21 v37.34,27.18
  Bottom 0.203: v37.34,27.18 38.1,27.18 42.16,31.24 42.16,35.18 JP6.1
AT328P_RST  (via drill 0.51)
  Top 0.203: v39.62,35.05 39.77,34.91 U2.29 39.77,27.54 40.64,26.67 v40.64,20.83 | R1.1 34.25,44.54 34.67,44.96 36.83,44.96 J1.5
  Bottom 0.203: U$2.P9.23 46.99,3.17 46.99,14.48 v40.64,20.83 | J1.5 39.62,44.7 v39.62,35.05
AUTH0  (via drill 0.51)
  Top 0.203: AES1.2 30.86,34.16 31.24,34.54 v31.24,37.59
  Bottom 0.203: v31.24,37.59 31.24,48.39 U$2.P8.11
D0  (via drill 0.51)
  Top 0.203: v36.83,19.56 36.83,21.84 JP3.2
  Bottom 0.203: U$2.P9.13 36.83,3.17 v36.83,19.56 | JP3.2 42.55,22.86 JP8.1
D0'  (via drill 0.51)
  Top 0.203: v41.66,25.4 41.66,26.42 40.57,27.5 U2.30
  Bottom 0.203: JP3.1 v41.66,25.4
D1  (via drill 0.51)
  Top 0.203: JP4.2 34.04,19.81 v34.29,19.56
  Bottom 0.203: v34.29,19.56 34.29,3.17 U$2.P9.11 | JP4.2 35.56,21.34 39.12,21.34 40.13,22.35 44.58,22.35 JP8.2
D1'  (via drill 0.51)
  Top 0.203: U2.31 41.37,27.46 42.67,26.16 42.67,24.89 v41.66,23.88
  Bottom 0.203: JP4.1 35.31,24.13 41.4,24.13 v41.66,23.88
D2
  Top 0.203: U2.32 49.38,28.73 JP5.3
D3
  Top 0.203: U2.1 50.42,30.22 JP5.4
D4
  Top 0.203: U2.2 49.44,31.02 JP5.5
D5
  Top 0.203: U2.9 42.9,37.31 43.18,37.59 48.13,37.59 JP5.6
D6
  Top 0.203: U2.10 41.37,38.07 41.66,38.35 42.67,38.35 42.93,38.1 50.16,38.1 JP5.7
D7
  Top 0.203: U2.11 40.57,38.03 41.4,38.86 42.93,38.86 43.18,38.61 49.4,38.61 JP5.8
D8
  Top 0.203: U2.12 39.77,37.99 43.05,41.27 49.53,41.27 JP5.9
D9
  Top 0.203: U2.13 38.97,37.95 44.83,43.81 49.53,43.81 JP5.10
D10
  Top 0.203: U2.14 38.17,38.17 46.35,46.35 49.53,46.35 JP5.11
GND  (via drill 0.51)
  other vias: 41.27,13.72 15.24,12.95 12.19,18.03 13.21,8.89 43.69,9.14 48.13,33.78 48.01,17.14 48.01,9.91 35.05,28.83 28.7,31.24
  pour Top (isolate 0.305, rank 6): 0,54.61 86.36,54.61 86.36,0 0,0
  pour Bottom (isolate 0.305): 0,54.61 86.36,54.61 86.36,0 0,0
I2C2_SCL  (via drill 0.51)
  Top 0.203: 17.98,10.92 24.3,10.92 R11.1 25.02,11.9 U3.6 25.02,15.11 26.54,16.64 27.84,16.64 28.35,16.13 30.1,16.13 31.9,17.93 TPM1.2 37.82,17.93 v38.48,17.27 39.5,18.29 39.5,21.46 39.88,21.84 39.88,26.67 38.97,27.58 U2.28 38.97,30.25 v38.86,30.35 | AES1.6 v25.53,35.43 | U$2.P9.19 44.45,3.17 44.45,5.33 46.1,6.99 JP7.1
  Top 0.254: SHA1.6 12.32,46.1 v12.45,45.97 | ECC1.6 26.04,46.1 v26.16,45.97 | RTC1.8 17.98,10.92
  Bottom 0.203: v38.48,17.27 38.48,12.19 41.91,8.76 41.91,3.17 U$2.P9.19 | v26.16,45.97 26.67,45.47 26.67,43.18 25.53,42.04 v25.53,35.43 32.38,35.43 37.47,30.35 v38.86,30.35
  Bottom 0.254: v12.45,45.97 v26.16,45.97
I2C2_SDA  (via drill 0.51)
  Top 0.203: RTC1.7 16.64,11.81 17.27,12.45 18.41,12.45 19.3,11.56 23.15,11.56 R10.1 | U3.5 23.75,15.11 25.78,17.14 28.07,17.14 28.57,16.64 29.84,16.64 31.8,18.59 TPM1.1 38.41,18.59 v38.48,18.67 38.99,19.18 38.99,21.72 39.37,22.1 39.37,26.42 38.17,27.62 U2.27 38.17,29.65 37.85,29.97 v37.85,31.37 | AES1.5 26.29,36.7 v26.67,36.32 | U$2.P9.20 43.18,4.83 45.97,7.62 51.44,7.62 JP7.2
  Top 0.254: U3.5 23.75,12.15 R10.1 | SHA1.5 12.32,47.37 v12.45,47.5 | ECC1.5 26.04,47.37 v26.16,47.5
  Bottom 0.203: v38.48,18.67 39.37,17.78 39.37,12.06 43.18,8.26 U$2.P9.20 | v26.16,47.5 27.18,46.48 27.18,42.93 26.67,42.42 v26.67,36.32 27.05,35.94 32.64,35.94 37.21,31.37 v37.85,31.37
  Bottom 0.254: v12.45,47.5 v26.16,47.5
MISO
  Top 0.203: U2.16 36.57,39.62 J1.1
MOSI
  Top 0.203: U2.15 37.37,39.4 37.59,39.62 38.86,39.62 39.62,40.39 39.62,41.91 39.12,42.42 36.83,42.42 J1.4
N$1
  Top 0.254: U3.7 26.29,12.57 JP13.1 27.18,10.67 R12.1
N$4
  Top 0.203: U2.7 44.48,35.02 45.27,34.23 Y2.1
N$5
  Top 0.203: U2.8 44.46,35.82 45.27,36.63 Y2.3
N$6  (via drill 1 pad 1.91)
  other vias: 53.34,47.62
N$12
  Top 0.203: R2.1 42.19,45.43 D1.A
N$18
  Top 0.254: U3.3 25.02,21.12 arc-90 R7.1
N$19
  Top 0.203: TPM1.27 43.46,17.93 43.94,18.41 45.63,18.41 R6.1
N$20
  Top 0.254: JP2.1 26.67,21.76 R8.1 26.29,20.54 U3.2
N$21
  Top 0.203: JP1.1 28.76,22.92 27.94,22.1 27.94,20.7 27.56,20.32 U3.1 27.56,18.29 28.61,18.29 R9.1
N$22
  Top 0.254: SJ1.3 23.57,9.87 R10.2
N$23
  Top 0.254: R11.2 25.15,8.18 SJ1.1
N$24  (via drill 1 pad 1.91)
  other vias: 81.28,42.55
N$26  (via drill 1 pad 1.91)
  other vias: 81.28,37.47
N$39  (via drill 1 pad 1.91)
  other vias: 55.88,47.62
N$40  (via drill 1 pad 1.91)
  other vias: 58.42,47.62
N$43  (via drill 1 pad 1.91)
  other vias: 60.96,47.62
N$45  (via drill 1 pad 1.91)
  other vias: 63.5,47.62
N$47  (via drill 1 pad 1.91)
  other vias: 66.04,47.62
N$50  (via drill 1 pad 1.91)
  other vias: 68.58,47.62
N$51  (via drill 1 pad 1.91)
  other vias: 71.12,47.62
N$52  (via drill 1 pad 1.91)
  other vias: 73.66,47.62
N$53  (via drill 1 pad 1.91)
  other vias: 76.2,47.62
N$57  (via drill 1 pad 1.91)
  other vias: 53.34,45.09
N$58  (via drill 1 pad 1.91)
  other vias: 55.88,45.09
N$59  (via drill 1 pad 1.91)
  other vias: 58.42,45.09
N$60  (via drill 1 pad 1.91)
  other vias: 60.96,45.09
N$61  (via drill 1 pad 1.91)
  other vias: 63.5,45.09
N$62  (via drill 1 pad 1.91)
  other vias: 66.04,45.09
N$63  (via drill 1 pad 1.91)
  other vias: 68.58,45.09
N$64  (via drill 1 pad 1.91)
  other vias: 71.12,45.09
N$65  (via drill 1 pad 1.91)
  other vias: 73.66,45.09
N$66  (via drill 1 pad 1.91)
  other vias: 76.2,45.09
N$71  (via drill 1 pad 1.91)
  other vias: 53.34,42.55
N$72  (via drill 1 pad 1.91)
  other vias: 55.88,42.55
N$73  (via drill 1 pad 1.91)
  other vias: 58.42,42.55
N$74  (via drill 1 pad 1.91)
  other vias: 60.96,42.55
N$75  (via drill 1 pad 1.91)
  other vias: 63.5,42.55
N$76  (via drill 1 pad 1.91)
  other vias: 66.04,42.55
N$77  (via drill 1 pad 1.91)
  other vias: 68.58,42.55
N$78  (via drill 1 pad 1.91)
  other vias: 71.12,42.55
N$79  (via drill 1 pad 1.91)
  other vias: 73.66,42.55
N$80  (via drill 1 pad 1.91)
  other vias: 76.2,42.55
N$81  (via drill 1 pad 1.91)
  other vias: 78.74,42.55
N$92  (via drill 1 pad 1.91)
  other vias: 53.34,40.01
N$94  (via drill 1 pad 1.91)
  other vias: 55.88,40.01
N$95  (via drill 1 pad 1.91)
  other vias: 58.42,40.01
N$96  (via drill 1 pad 1.91)
  other vias: 60.96,40.01
N$97  (via drill 1 pad 1.91)
  other vias: 63.5,40.01
N$98  (via drill 1 pad 1.91)
  other vias: 66.04,40.01
N$99  (via drill 1 pad 1.91)
  other vias: 68.58,40.01
N$100  (via drill 1 pad 1.91)
  other vias: 71.12,40.01
N$101  (via drill 1 pad 1.91)
  other vias: 73.66,40.01
N$102  (via drill 1 pad 1.91)
  other vias: 76.2,40.01
N$103  (via drill 1 pad 1.91)
  other vias: 78.74,40.01
N$106  (via drill 1 pad 1.91)
  other vias: 53.34,37.47
N$107  (via drill 1 pad 1.91)
  other vias: 55.88,37.47
N$108  (via drill 1 pad 1.91)
  other vias: 58.42,37.47
N$109  (via drill 1 pad 1.91)
  other vias: 60.96,37.47
N$110  (via drill 1 pad 1.91)
  other vias: 63.5,37.47
N$111  (via drill 1 pad 1.91)
  other vias: 66.04,37.47
N$112  (via drill 1 pad 1.91)
  other vias: 68.58,37.47
N$113  (via drill 1 pad 1.91)
  other vias: 71.12,37.47
N$114  (via drill 1 pad 1.91)
  other vias: 73.66,37.47
N$115  (via drill 1 pad 1.91)
  other vias: 76.2,37.47
N$116  (via drill 1 pad 1.91)
  other vias: 78.74,37.47
N$117  (via drill 1 pad 1.91)
  other vias: 81.28,40.01
N$126  (via drill 1 pad 1.91)
  other vias: 53.34,34.92
N$127  (via drill 1 pad 1.91)
  other vias: 55.88,34.92
N$128  (via drill 1 pad 1.91)
  other vias: 58.42,34.92
N$129  (via drill 1 pad 1.91)
  other vias: 60.96,34.92
N$130  (via drill 1 pad 1.91)
  other vias: 63.5,34.92
N$131  (via drill 1 pad 1.91)
  other vias: 66.04,34.92
N$132  (via drill 1 pad 1.91)
  other vias: 68.58,34.92
N$133  (via drill 1 pad 1.91)
  other vias: 71.12,34.92
N$134  (via drill 1 pad 1.91)
  other vias: 73.66,34.92
N$135  (via drill 1 pad 1.91)
  other vias: 76.2,34.92
N$136  (via drill 1 pad 1.91)
  other vias: 78.74,34.92
N$137  (via drill 1 pad 1.91)
  other vias: 81.28,34.92
N$139  (via drill 1 pad 1.91)
  other vias: 53.34,32.38
N$140  (via drill 1 pad 1.91)
  other vias: 55.88,32.38
N$141  (via drill 1 pad 1.91)
  other vias: 58.42,32.38
N$142  (via drill 1 pad 1.91)
  other vias: 60.96,32.38
N$143  (via drill 1 pad 1.91)
  other vias: 63.5,32.38
N$144  (via drill 1 pad 1.91)
  other vias: 66.04,32.38
N$145  (via drill 1 pad 1.91)
  other vias: 68.58,32.38
N$146  (via drill 1 pad 1.91)
  other vias: 71.12,32.38
N$147  (via drill 1 pad 1.91)
  other vias: 73.66,32.38
N$148  (via drill 1 pad 1.91)
  other vias: 76.2,32.38
N$149  (via drill 1 pad 1.91)
  other vias: 78.74,32.38
N$150  (via drill 1 pad 1.91)
  other vias: 81.28,32.38
N$159  (via drill 1 pad 1.91)
  other vias: 53.34,29.84
N$160  (via drill 1 pad 1.91)
  other vias: 55.88,29.84
N$161  (via drill 1 pad 1.91)
  other vias: 58.42,29.84
N$162  (via drill 1 pad 1.91)
  other vias: 60.96,29.84
N$163  (via drill 1 pad 1.91)
  other vias: 63.5,29.84
N$164  (via drill 1 pad 1.91)
  other vias: 66.04,29.84
N$165  (via drill 1 pad 1.91)
  other vias: 68.58,29.84
N$166  (via drill 1 pad 1.91)
  other vias: 71.12,29.84
N$167  (via drill 1 pad 1.91)
  other vias: 73.66,29.84
N$168  (via drill 1 pad 1.91)
  other vias: 76.2,29.84
N$169  (via drill 1 pad 1.91)
  other vias: 78.74,29.84
N$170  (via drill 1 pad 1.91)
  other vias: 81.28,29.84
N$172  (via drill 1 pad 1.91)
  other vias: 53.34,27.3
N$173  (via drill 1 pad 1.91)
  other vias: 55.88,27.3
N$174  (via drill 1 pad 1.91)
  other vias: 58.42,27.3
N$175  (via drill 1 pad 1.91)
  other vias: 60.96,27.3
N$176  (via drill 1 pad 1.91)
  other vias: 63.5,27.3
N$177  (via drill 1 pad 1.91)
  other vias: 66.04,27.3
N$178  (via drill 1 pad 1.91)
  other vias: 68.58,27.3
N$179  (via drill 1 pad 1.91)
  other vias: 71.12,27.3
N$180  (via drill 1 pad 1.91)
  other vias: 73.66,27.3
N$181  (via drill 1 pad 1.91)
  other vias: 76.2,27.3
N$182  (via drill 1 pad 1.91)
  other vias: 78.74,27.3
N$183  (via drill 1 pad 1.91)
  other vias: 81.28,27.3
N$192  (via drill 1 pad 1.91)
  other vias: 53.34,24.77
N$193  (via drill 1 pad 1.91)
  other vias: 55.88,24.77
N$194  (via drill 1 pad 1.91)
  other vias: 58.42,24.77
N$195  (via drill 1 pad 1.91)
  other vias: 60.96,24.77
N$196  (via drill 1 pad 1.91)
  other vias: 63.5,24.77
N$197  (via drill 1 pad 1.91)
  other vias: 66.04,24.77
N$198  (via drill 1 pad 1.91)
  other vias: 68.58,24.77
N$199  (via drill 1 pad 1.91)
  other vias: 71.12,24.77
N$200  (via drill 1 pad 1.91)
  other vias: 73.66,24.77
N$201  (via drill 1 pad 1.91)
  other vias: 76.2,24.77
N$202  (via drill 1 pad 1.91)
  other vias: 78.74,24.77
N$203  (via drill 1 pad 1.91)
  other vias: 81.28,24.77
N$205  (via drill 1 pad 1.91)
  other vias: 53.34,22.23
N$206  (via drill 1 pad 1.91)
  other vias: 55.88,22.23
N$207  (via drill 1 pad 1.91)
  other vias: 58.42,22.23
N$208  (via drill 1 pad 1.91)
  other vias: 60.96,22.23
N$209  (via drill 1 pad 1.91)
  other vias: 63.5,22.23
N$210  (via drill 1 pad 1.91)
  other vias: 66.04,22.23
N$211  (via drill 1 pad 1.91)
  other vias: 68.58,22.23
N$212  (via drill 1 pad 1.91)
  other vias: 71.12,22.23
N$213  (via drill 1 pad 1.91)
  other vias: 73.66,22.23
N$214  (via drill 1 pad 1.91)
  other vias: 76.2,22.23
N$225  (via drill 1 pad 1.91)
  other vias: 53.34,19.68
N$226  (via drill 1 pad 1.91)
  other vias: 55.88,19.68
N$227  (via drill 1 pad 1.91)
  other vias: 58.42,19.68
N$228  (via drill 1 pad 1.91)
  other vias: 60.96,19.68
N$229  (via drill 1 pad 1.91)
  other vias: 63.5,19.68
N$230  (via drill 1 pad 1.91)
  other vias: 66.04,19.68
N$231  (via drill 1 pad 1.91)
  other vias: 68.58,19.68
N$232  (via drill 1 pad 1.91)
  other vias: 71.12,19.68
N$233  (via drill 1 pad 1.91)
  other vias: 73.66,19.68
N$238  (via drill 1 pad 1.91)
  other vias: 53.34,17.14
N$239  (via drill 1 pad 1.91)
  other vias: 55.88,17.14
N$240  (via drill 1 pad 1.91)
  other vias: 58.42,17.14
N$241  (via drill 1 pad 1.91)
  other vias: 60.96,17.14
N$242  (via drill 1 pad 1.91)
  other vias: 63.5,17.14
N$243  (via drill 1 pad 1.91)
  other vias: 66.04,17.14
N$244  (via drill 1 pad 1.91)
  other vias: 68.58,17.14
N$245  (via drill 1 pad 1.91)
  other vias: 71.12,17.14
N$246  (via drill 1 pad 1.91)
  other vias: 73.66,17.14
N$258  (via drill 1 pad 1.91)
  other vias: 53.34,14.61
N$259  (via drill 1 pad 1.91)
  other vias: 55.88,14.61
N$260  (via drill 1 pad 1.91)
  other vias: 58.42,14.61
N$261  (via drill 1 pad 1.91)
  other vias: 60.96,14.61
N$262  (via drill 1 pad 1.91)
  other vias: 63.5,14.61
N$263  (via drill 1 pad 1.91)
  other vias: 66.04,14.61
N$264  (via drill 1 pad 1.91)
  other vias: 68.58,14.61
N$265  (via drill 1 pad 1.91)
  other vias: 71.12,14.61
N$266  (via drill 1 pad 1.91)
  other vias: 73.66,14.61
N$271  (via drill 1 pad 1.91)
  other vias: 53.34,12.06
N$272  (via drill 1 pad 1.91)
  other vias: 55.88,12.06
N$273  (via drill 1 pad 1.91)
  other vias: 58.42,12.06
N$274  (via drill 1 pad 1.91)
  other vias: 60.96,12.06
N$275  (via drill 1 pad 1.91)
  other vias: 63.5,12.06
N$276  (via drill 1 pad 1.91)
  other vias: 66.04,12.06
N$277  (via drill 1 pad 1.91)
  other vias: 68.58,12.06
N$278  (via drill 1 pad 1.91)
  other vias: 71.12,12.06
N$279  (via drill 1 pad 1.91)
  other vias: 73.66,12.06
N$280  (via drill 1 pad 1.91)
  other vias: 76.2,12.06
N$292  (via drill 1 pad 1.91)
  other vias: 55.88,9.53
N$293  (via drill 1 pad 1.91)
  other vias: 58.42,9.53
N$294  (via drill 1 pad 1.91)
  other vias: 60.96,9.53
N$295  (via drill 1 pad 1.91)
  other vias: 63.5,9.53
N$296  (via drill 1 pad 1.91)
  other vias: 66.04,9.53
N$297  (via drill 1 pad 1.91)
  other vias: 68.58,9.53
N$298  (via drill 1 pad 1.91)
  other vias: 71.12,9.53
N$299  (via drill 1 pad 1.91)
  other vias: 73.66,9.53
N$300  (via drill 1 pad 1.91)
  other vias: 76.2,9.53
N$305  (via drill 1 pad 1.91)
  other vias: 55.88,6.99
N$306  (via drill 1 pad 1.91)
  other vias: 58.42,6.99
N$307  (via drill 1 pad 1.91)
  other vias: 60.96,6.99
N$308  (via drill 1 pad 1.91)
  other vias: 63.5,6.99
N$309  (via drill 1 pad 1.91)
  other vias: 66.04,6.99
N$310  (via drill 1 pad 1.91)
  other vias: 68.58,6.99
N$311  (via drill 1 pad 1.91)
  other vias: 71.12,6.99
N$312  (via drill 1 pad 1.91)
  other vias: 73.66,6.99
N$313  (via drill 1 pad 1.91)
  other vias: 76.2,6.99
SCK  (via drill 0.51)
  Top 0.203: U2.17 35.05,35.84 34.26,35.84 34.04,36.07 v34.04,37.08 | R2.2 38.14,43.73 J1.3
  Bottom 0.203: J1.3 36.83,42.42 34.54,42.42 34.04,41.91 v34.04,37.08
SQW
  Top 0.305: RTC1.3 15.37,17.91 JP14.2
SYS_RESET
  Top 0.254: U$2.P9.10 30.48,4.83 31.75,6.1 36.83,6.1 41.4,10.67 TPM1.16
TPM_CLK
  Top 0.203: TPM1.21 43.56,13.97 44.15,13.38 U1.3
VBAT  (via drill 1 pad 1.78)
  Top 0.406: RTC1.6 15.37,9.27 v9.02,2.92 BAT1.PWR@1

### Text on the board
Bottom: v02
tPlace: ISP | A0 | D10 | D13 | A1 | D9 | A2 | D8 | SHA-256 | ECC | A3 | D7 | D6 | D5 | D4 | D3 | CryptoCape | AES-128 | D0 | D2 | A1 | A0 | D1 | 3.3v | PROGRAM | JUMPERS | m328P | GND | SQW/INT | 32KHZ | Cryptotronix | WP | SDA | CAPE EEPROM | RTC | PU EN | SCL | TPM
bPlace: A0 | D10 | A1 | D9 | CryptoCape | A2 | D8 | A3 | D7 | D6 | D5 | D4 | D3 | Cryptotronix | D0 | D2 | D1 | 3.3v | JUMPERS | PROGRAM | GND | SQW/INT | 32KHZ | WP | SDA | SCL
tDocu: Josh Datko / Casey Kuhns